# EAGLE design LOW_pass_RC (EAGLE 6.5.0)
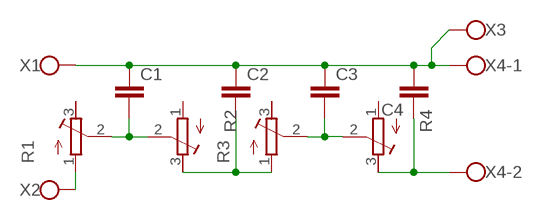
[diagram p0: schematic, sheet 1]

## Parts
C1  C-EU050-030X075  [C050-030X075]
C2  C-EU050-030X075  [C050-030X075]
C3  C-EU050-030X075  [C050-030X075]
C4  C-EU050-030X075  [C050-030X075]
R1  R-TRIMM64W  [RTRIM64W]
R2  R-TRIMM64W  [RTRIM64W]
R3  R-TRIMM64W  [RTRIM64W]
R4  R-TRIMM64W  [RTRIM64W]
X1  W237-112  [W237-112]
X2  W237-112  [W237-112]
X3  W237-112  [W237-112]
X4  W237-102  [W237-102]

## Nets
N$1: C1.1 C2.1 C3.1 C4.2 X1.1(KL) X3.1(KL) X4.1
N$2: R1.1(A) X2.1(KL)
N$3: C1.2 R1.2(S) R2.2(S)
N$4: C2.2 R2.3(E) R3.1(A)
N$5: C3.2 R3.2(S) R4.2(S)
N$6: C4.1 R4.3(E) X4.2
Unconnected: R1.3(E) R2.1(A) R3.3(E) R4.1(A)

## Library data of the parts
C1-C4 = rcl:C-EU: CAPACITOR, European symbol
R1-R4 = rcl:R-TRIMM: Trimm resistor
X1-X3 = con-wago-500:W237-112: WAGO SCREW CLAMP; MPN: 237-112; OC_FARNELL: unknown; OC_NEWARK: 76R2974
X4 = con-wago-500:W237-102: WAGO SCREW CLAMP; MPN: 237-102; OC_FARNELL: unknown; OC_NEWARK: 70K9898

## Board
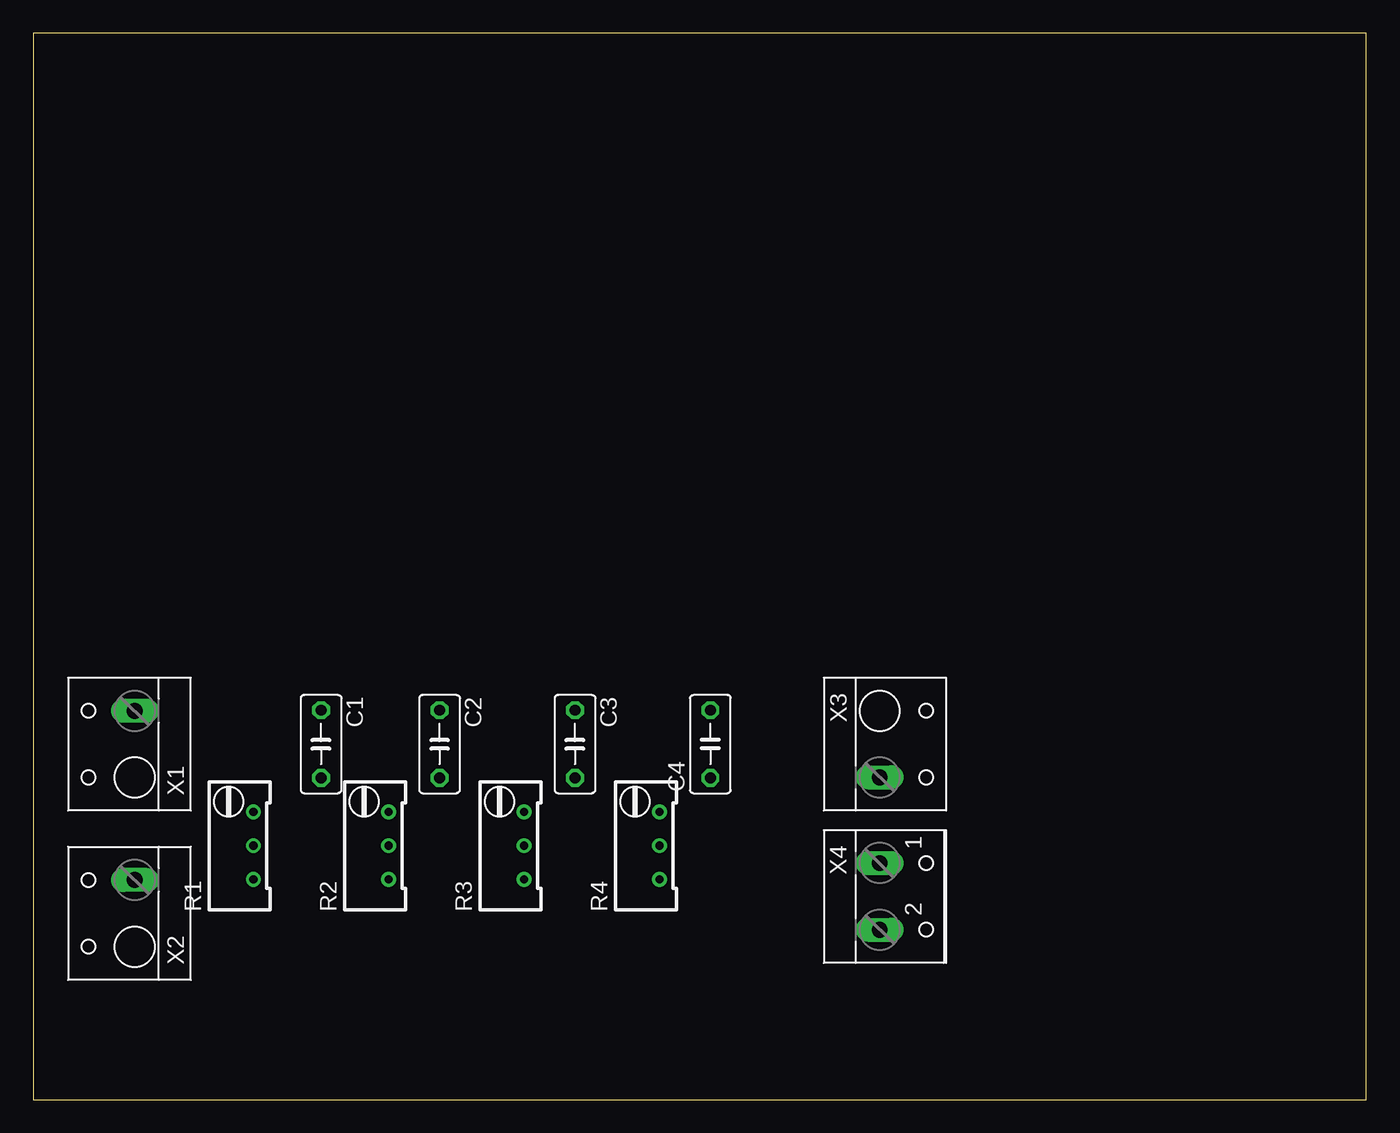
[diagram p1: board, top side]
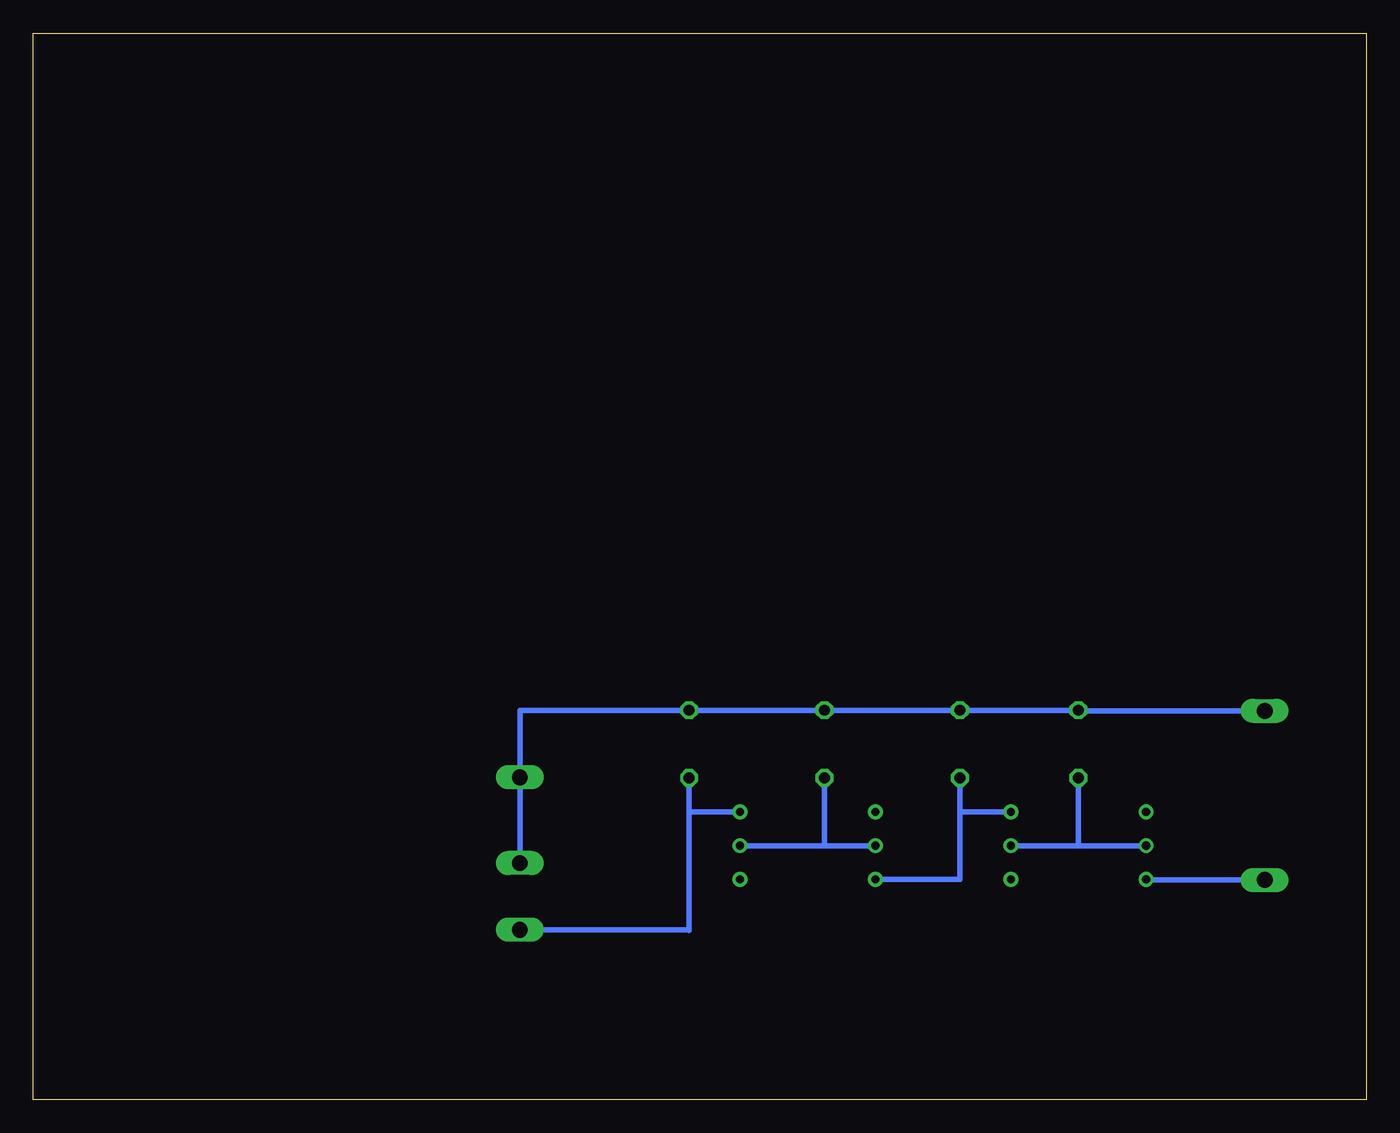
[diagram p2: board, bottom side, seen from below]

Size 100 x 80 mm. Coordinates in mm from the lower left corner, seen from the top.
Outline: 0,0 100,0 100,80 0,80 0,0
Copper layers (1*16): Top 0.035mm / dielectric 1.5mm / Bottom 0.035mm
Design rules "default": minimum track width 10mil, minimum drill 24mil, track to track 8mil, track to pad 8mil, pad to pad 8mil, via to via 8mil, smd to smd 8mil, copper to edge 40mil, drill to drill 8mil, minimum pad ring 10mil, minimum via ring 8mil, stop-mask expansion 4mil, vias tented up to drill 0mil, thermal gap 10mil

### Footprints (pad centres in the part's own frame; a part is rotated, then mirrored left to right if it is on the bottom)
C050-030X075 = drill 0.813 octagon: 1 -2.54,0; 2 2.54,0
RTRIM64W = drill 0.61: 1 1.27,-2.54; 2 1.27,0; 3 1.27,2.54
W237-112 = drill 1.194 long: 1 2.5,-1.27
W237-102 = drill 1.194 long: 1 -2.5,-1.27; 2 2.5,-1.27

### Placement (x,y rotation side)
C1  21.59,26.67 270 top
C2  30.48,26.67 270 top
C3  40.64,26.67 270 top
C4  50.8,26.67 90 top
R1  15.24,19.05 0 top
R2  25.4,19.05 0 top
R3  35.56,19.05 0 top
R4  45.72,19.05 0 top
X1  6.35,26.67 90 top
X2  6.35,13.97 90 top
X3  64.77,26.67 270 top
X4  64.77,15.24 270 top

### Tracks (layer width: path | path; a pad name or v marks a point on that pad's centre or on a via)
N$1
  Bottom 0.406: X1.1 21.59,29.17 C1.1 C2.1 C3.1 C4.2 63.5,29.21 X3.1 X4.1
N$2
  Bottom 0.406: X2.1 16.51,16.47 R1.1
N$3
  Bottom 0.406: R1.2 21.59,19.05 | 21.59,19.05 R2.2 | C1.2 21.59,19.05
N$4
  Bottom 0.406: R2.3 30.48,21.59 | 30.48,21.59 C2.2 | R3.1 30.48,16.51 30.48,21.59
N$5
  Bottom 0.406: R3.2 R4.2 40.64,19.05 C3.2
N$6
  Bottom 0.406: X4.2 50.8,12.74 | 50.8,12.74 50.8,12.7 | 50.8,12.74 50.8,21.59 | C4.1 50.8,21.59 | 50.8,21.59 R4.3